# EAGLE design uRings_SE_Control_Board (EAGLE 9.6.2)
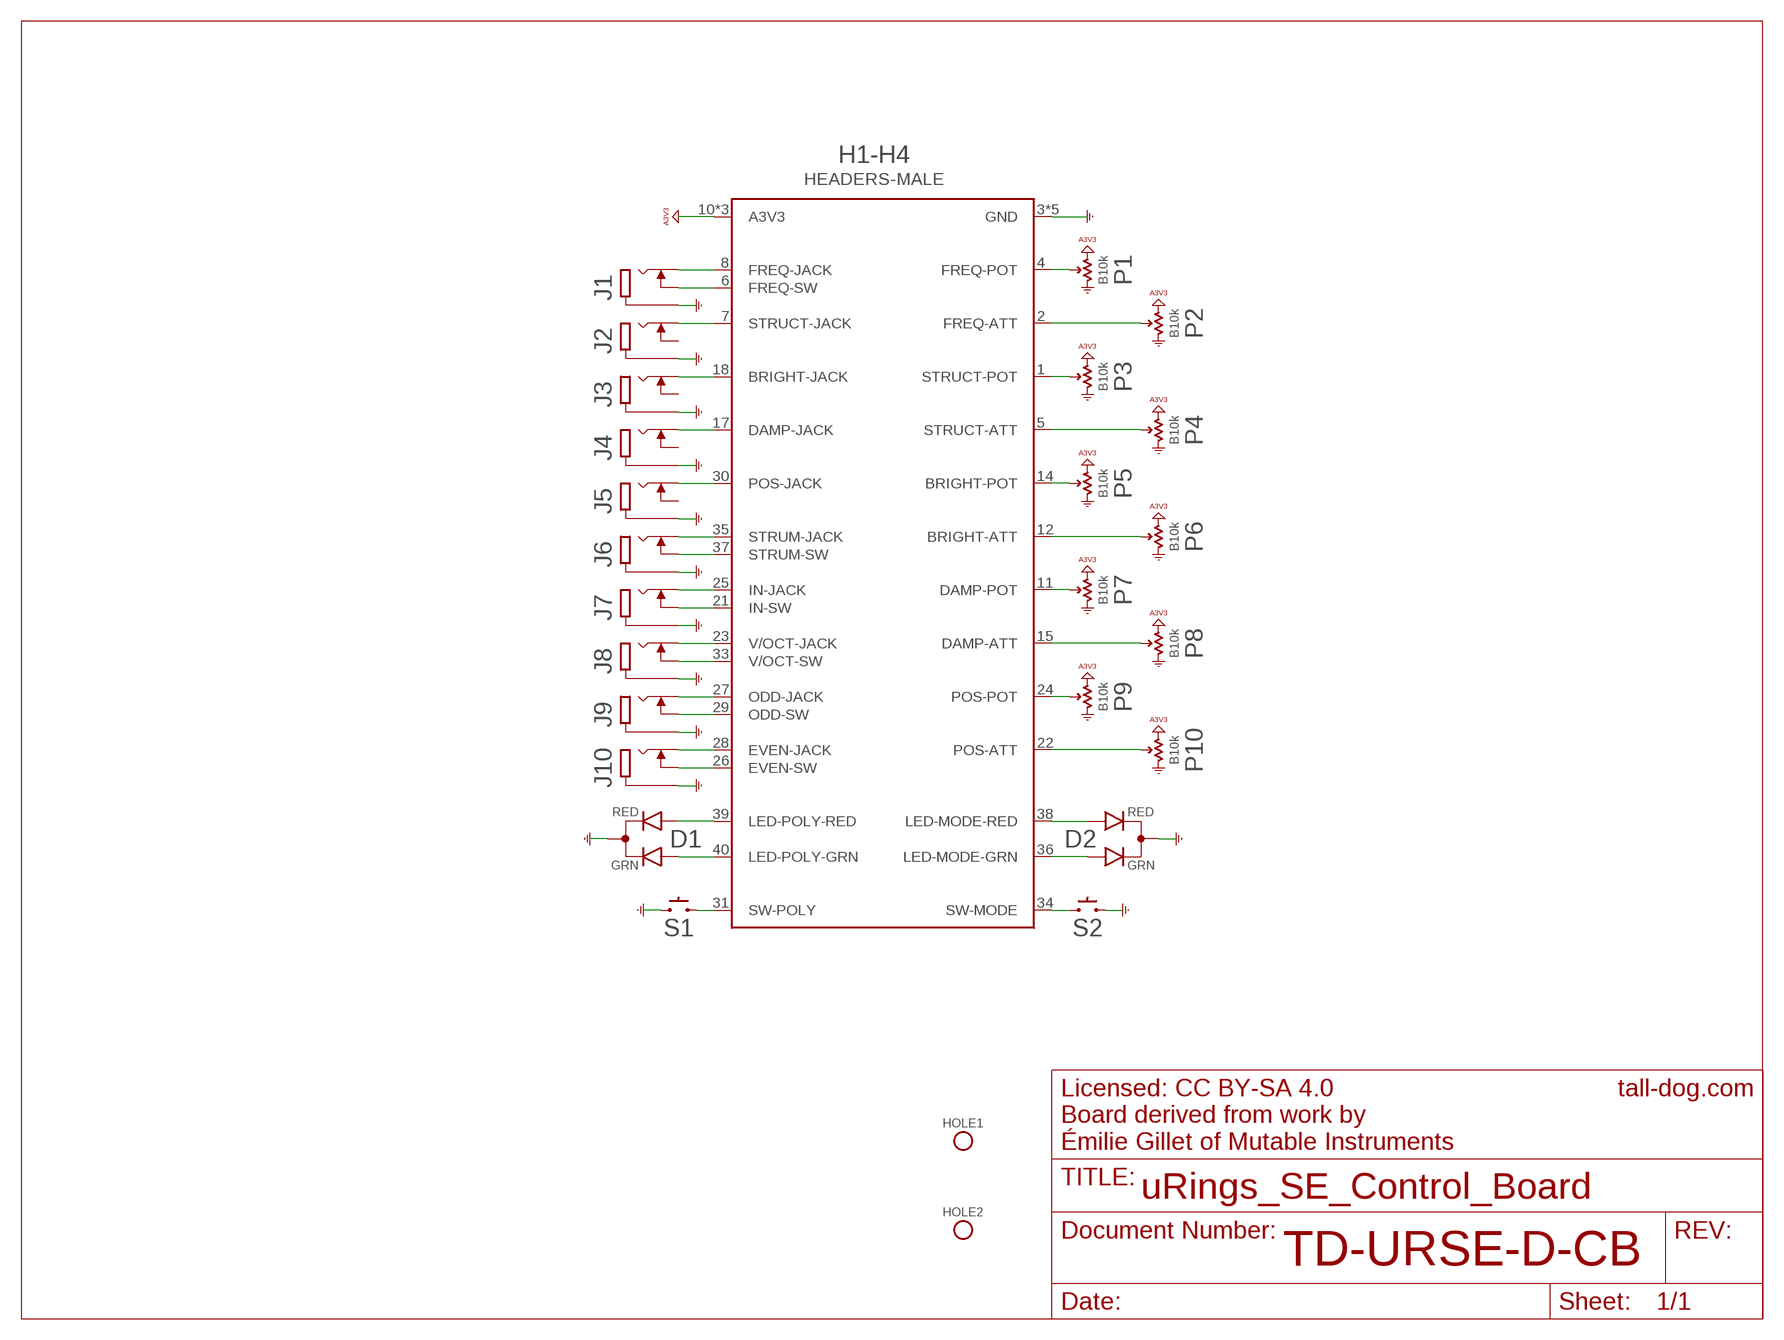
[diagram p0: schematic, sheet 1]

## Parts
D1  LED-DUAL  [LED-T1-3]
D2  LED-DUAL  [LED-T1-3]
H1-H4  HEADERS-MALE  [HEADERS-MALE]
HOLE1  HOLE  [M2.5-HOLE]
HOLE2  HOLE  [M2.5-HOLE]
J1  JACK  [JACK]
J2  JACK  [JACK]
J3  JACK  [JACK]
J4  JACK  [JACK]
J5  JACK  [JACK]
J6  JACK  [JACK]
J7  JACK  [JACK]
J8  JACK  [JACK]
J9  JACK  [JACK]
J10  JACK  [JACK]
P1  B10k  POT  [POT]
P2  B10k  POT  [POT]
P3  B10k  POT  [POT]
P4  B10k  POT  [POT]
P5  B10k  POT  [POT]
P6  B10k  POT  [POT]
P7  B10k  POT  [POT]
P8  B10k  POT  [POT]
P9  B10k  POT  [POT]
P10  B10k  POT  [POT]
S1  SPST  [TL1105]
S2  SPST  [TL1105]

## Nets
A3V3: H1-H4.10(A3V3) H1-H4.16(A3V3) H1-H4.20(A3V3) P1.P$1(E) P2.P$1(E) P3.P$1(E) P4.P$1(E) P5.P$1(E) P6.P$1(E) P7.P$1(E) P8.P$1(E) P9.P$1(E) P10.P$1(E)
BRIGHT-ATT: H1-H4.12(BRIGHT-ATT) P6.P$2(S)
BRIGHT-JACK: H1-H4.18(BRIGHT-JACK) J3.P3
BRIGHT-POT: H1-H4.14(BRIGHT-POT) P5.P$2(S)
DAMP-ATT: H1-H4.15(DAMP-ATT) P8.P$2(S)
DAMP-JACK: H1-H4.17(DAMP-JACK) J4.P3
DAMP-POT: H1-H4.11(DAMP-POT) P7.P$2(S)
EVEN-JACK: H1-H4.28(EVEN-JACK) J10.P3
EVEN-SW: H1-H4.26(EVEN-SW) J10.P2
FREQ-ATT: H1-H4.2(FREQ-ATT) P2.P$2(S)
FREQ-JACK: H1-H4.8(FREQ-JACK) J1.P3
FREQ-POT: H1-H4.4(FREQ-POT) P1.P$2(S)
FREQ-SW: H1-H4.6(FREQ-SW) J1.P2
GND: D1.2(C) D2.2(C) H1-H4.3(GND) H1-H4.9(GND) H1-H4.13(GND) H1-H4.19(GND) H1-H4.32(GND) J1.P1 J2.P1 J3.P1 J4.P1 J5.P1 J6.P1 J7.P1 J8.P1 J9.P1 J10.P1 P1.P$3(A) P2.P$3(A) P3.P$3(A) P4.P$3(A) P5.P$3(A) P6.P$3(A) P7.P$3(A) P8.P$3(A) P9.P$3(A) P10.P$3(A) S1.1 S1.2 S2.1 S2.2
IN-JACK: H1-H4.25(IN-JACK) J7.P3
IN-SW: H1-H4.21(IN-SW) J7.P2
LED-MODE-GRN: D2.3(GRN) H1-H4.36(LED-MODE-GRN)
LED-MODE-RED: D2.1(RED) H1-H4.38(LED-MODE-RED)
LED-POLY-GRN: D1.3(GRN) H1-H4.40(LED-POLY-GRN)
LED-POLY-RED: D1.1(RED) H1-H4.39(LED-POLY-RED)
ODD-JACK: H1-H4.27(ODD-JACK) J9.P3
ODD-SW: H1-H4.29(ODD-SW) J9.P2
POS-ATT: H1-H4.22(POS-ATT) P10.P$2(S)
POS-JACK: H1-H4.30(POS-JACK) J5.P3
POS-POT: H1-H4.24(POS-POT) P9.P$2(S)
STRUCT-ATT: H1-H4.5(STRUCT-ATT) P4.P$2(S)
STRUCT-JACK: H1-H4.7(STRUCT-JACK) J2.P3
STRUCT-POT: H1-H4.1(STRUCT-POT) P3.P$2(S)
STRUM-JACK: H1-H4.35(STRUM-JACK) J6.P3
STRUM-SW: H1-H4.37(STRUM-SW) J6.P2
SW-MODE: H1-H4.34(SW-MODE) S2.3 S2.4
SW-POLY: H1-H4.31(SW-POLY) S1.3 S1.4
V/OCT-JACK: H1-H4.23(V/OCT-JACK) J8.P3
V/OCT-SW: H1-H4.33(V/OCT-SW) J8.P2
Unconnected: HOLE1.P$1 HOLE1.P$2 HOLE1.P$3 HOLE1.P$4 HOLE1.P$5 HOLE1.P$6 HOLE1.P$7 HOLE1.P$8 HOLE1.P$9 HOLE2.P$1 HOLE2.P$2 HOLE2.P$3 HOLE2.P$4 HOLE2.P$5 HOLE2.P$6 HOLE2.P$7 HOLE2.P$8 HOLE2.P$9 J2.P2 J3.P2 J4.P2 J5.P2

## Notes on the sheet
- tall-dog.com
- Licensed: CC BY-SA 4.0
  Board derived from work by
  Émilie Gillet of Mutable Instruments
- TD-URSE-D-CB

## Library data of the parts
D1 D2 = uRings_SE_Library:LED-DUAL
H1-H4 = uRings_SE_Library:HEADERS-MALE
HOLE1 HOLE2 = uRings_SE_Library:HOLE
J1-J10 = uRings_SE_Library:JACK
P1-P10 = uRings_SE_Library:POT
S1 S2 = uRings_SE_Library:SPST

## Board
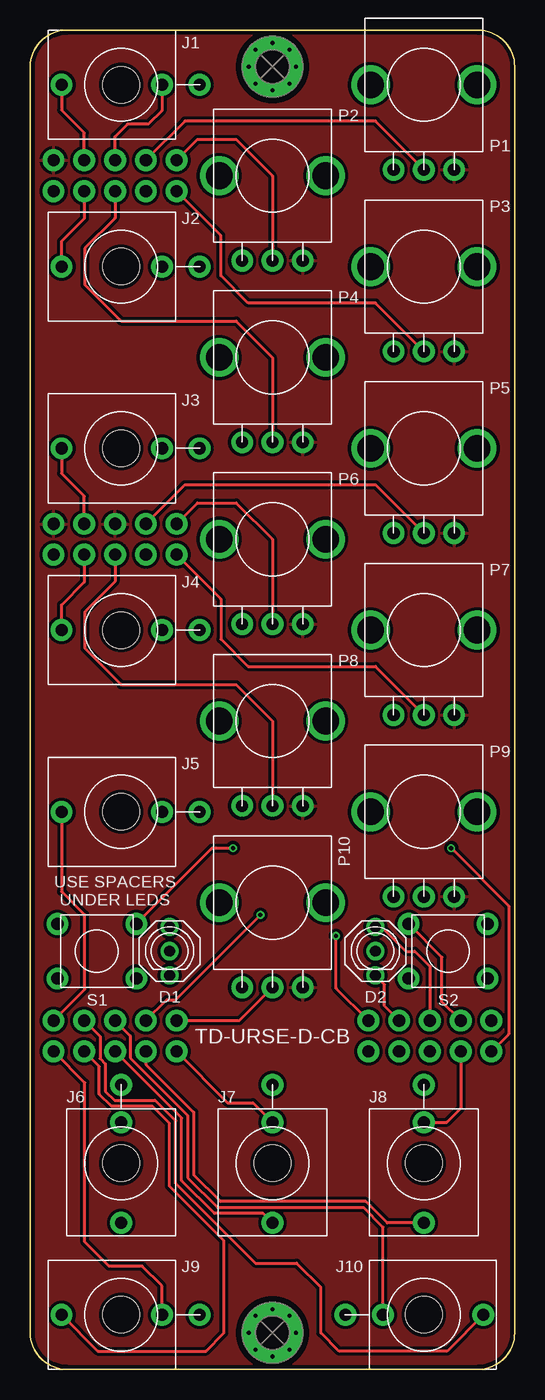
[diagram p1: board, top side]
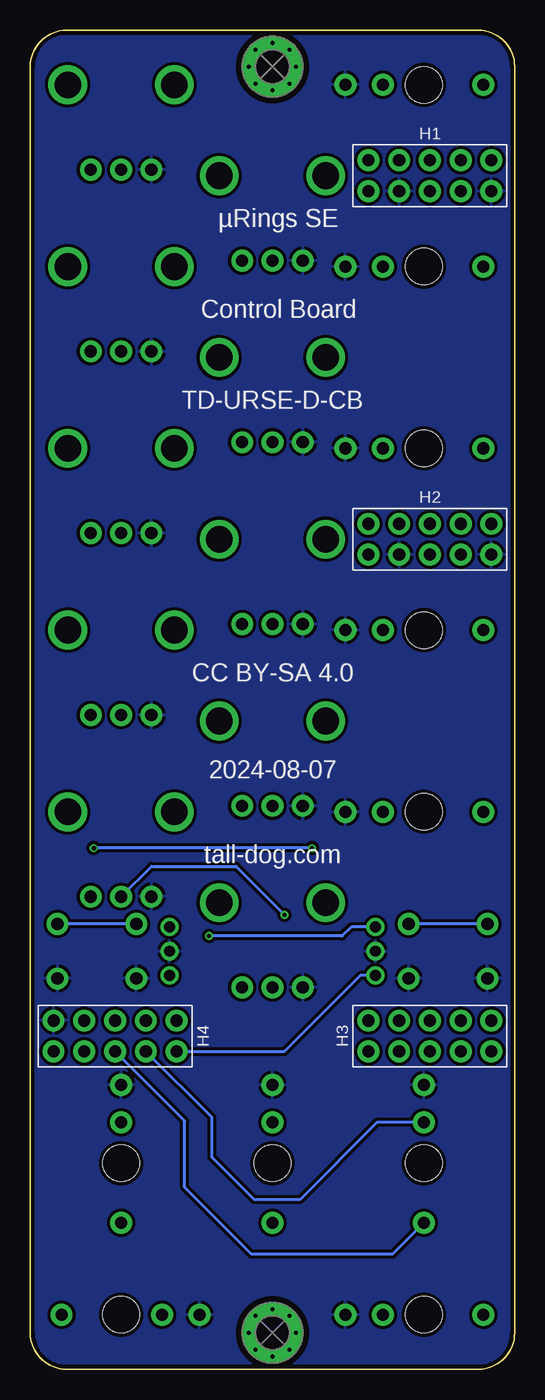
[diagram p2: board, bottom side, seen from below]

Size 40 x 110.5 mm. Coordinates in mm from the lower left corner, seen from the top.
Outline: 3,0 37,0 arc90 40,3 40,107.5 arc90 37,110.5 3,110.5 arc90 0,107.5 0,3 arc90 3,0
Copper layers (1*16): Top 0.035mm / dielectric 1.5mm / Bottom 0.035mm
Design rules "brds *": minimum track width 0.25mm, minimum drill 0.25mm, track to track 6mil, track to pad 6mil, pad to pad 6mil, via to via 6mil, smd to smd 0mil, copper to edge 12mil, drill to drill 8mil, minimum pad ring 6mil, minimum via ring 6mil, stop-mask expansion 0mil, vias tented up to drill 0.35mm, thermal gap 10mil

### Footprints (pad centres in the part's own frame; a part is rotated, then mirrored left to right if it is on the bottom)
LED-T1-3 = drill 0.9 pad 1.5: 1 -2,0; 2 0,0; 3 2,0
HEADERS-MALE = drill 1 pad 1.8: 1 12.08,97.23; 2 12.08,99.77; 3 9.54,97.23; 4 9.54,99.77; 5 7,97.23; 6 7,99.77; 7 4.46,97.23; 8 4.46,99.77; 9 1.92,97.23; 10 1.92,99.77; 11 12.08,67.23; 12 12.08,69.77; 13 9.54,67.23; 14 9.54,69.77; 15 7,67.23; 16 7,69.77; 17 4.46,67.23; 18 4.46,69.77; 19 1.92,67.23; 20 1.92,69.77; 21 12.08,26.23; 22 12.08,28.77; 23 9.54,26.23; 24 9.54,28.77; 25 7,26.23; 26 7,28.77; 27 4.46,26.23; 28 4.46,28.77; 29 1.92,26.23; 30 1.92,28.77; 31 38.08,26.23; 32 38.08,28.77; 33 35.54,26.23; 34 35.54,28.77; 35 33,26.23; 36 33,28.77; 37 30.46,26.23; 38 30.46,28.77; 39 27.92,26.23; 40 27.92,28.77
M2.5-HOLE = drill 2.75 pad 5: P$1 0,0 | drill 0.35: P$2 0,1.95; P$3 0,-1.95; P$4 -1.95,0; P$5 1.95,0; P$6 1.4,1.4; P$7 -1.4,1.4; P$8 -1.4,-1.4; P$9 1.4,-1.4
JACK = drill 1 pad 1.8: P1 0,-6.48; P2 0,-3.38; P3 0,4.92 | hole 3: 0,0
POT = drill 1 pad 1.8: P$1 -2.5,7; P$2 0,7; P$3 2.5,7 | drill 2.2 pad 3.2: P$4 -4.4,0; P$5 4.4,0
TL1105 = drill 1.016 pad 1.778: 1 -3.25,-2.25; 2 3.25,-2.25; 3 -3.25,2.25; 4 3.25,2.25

### Placement (x,y rotation side)
D1  11.5,34.5 90 top
D2  28.5,34.5 90 top
H1-H4  0,0 0 top
HOLE1  20,107.5 0 top
HOLE2  20,3 0 top
J1  7.5,106 90 top
J2  7.5,91 90 top
J3  7.5,76 90 top
J4  7.5,61 90 top
J5  7.5,46 90 top
J6  7.5,17 180 top
J7  20,17 180 top
J8  32.5,17 180 top
J9  7.5,4.5 90 top
J10  32.5,4.5 270 top
P1  32.5,106 180 top
P2  20,98.5 180 top
P3  32.5,91 180 top
P4  20,83.5 180 top
P5  32.5,76 180 top
P6  20,68.5 180 top
P7  32.5,61 180 top
P8  20,53.5 180 top
P9  32.5,46 180 top
P10  20,38.5 180 top
S1  5.5,34.5 0 top
S2  34.5,34.5 0 top
U$1  [LED-SPACER]  11.5,34.5 0 top
U$2  [LED-SPACER]  28.5,34.5 0 top

### Tracks (layer width: path | path; a pad name or v marks a point on that pad's centre or on a via)
A3V3
  pour Top (isolate 0.25): 0,110.5 40,110.5 40,0 0,0
BRIGHT-ATT
  Top 0.25: H1-H4.12 13.81,71.5 17,71.5 20,68.5 P6.P$2
BRIGHT-JACK
  Top 0.25: J3.P3 2.58,73.92 4.46,72.04 H1-H4.18
BRIGHT-POT
  Top 0.25: H1-H4.14 12.77,73 28.5,73 P5.P$2
DAMP-ATT
  Top 0.25: P8.P$2 20,53.5 17,56.5 7.5,56.5 4.5,59.5 4.5,62.5 7,65 H1-H4.15
DAMP-JACK
  Top 0.25: J4.P3 2.58,63.08 4.46,64.96 H1-H4.17
DAMP-POT
  Top 0.25: H1-H4.11 15.75,63.56 15.75,60.25 18,58 28.5,58 P7.P$2
EVEN-JACK
  Top 0.25: H1-H4.28 5.75,27.48 5.75,25.65 6.2,25.2 6.2,22.95 6.95,22.2 10.3,22.2 12,20.5 12,15.33 18.58,8.75 22,8.75 24,6.75 24,3 25.5,1.5 34.42,1.5 J10.P3
EVEN-SW
  Top 0.25: H1-H4.26 8.25,27.52 8.25,25.7 13,20.95 13,15.8 15.45,13.35 27.5,13.35 29.12,11.73 J10.P2
FREQ-ATT
  Top 0.25: H1-H4.2 13.81,101.5 17,101.5 20,98.5 P2.P$2
FREQ-JACK
  Top 0.25: H1-H4.8 4.46,102.04 2.58,103.92 J1.P3
FREQ-POT
  Top 0.25: P1.P$2 28.5,103 12.77,103 H1-H4.4
FREQ-SW
  Top 0.25: H1-H4.6 7,101.73 8.02,102.75 9.75,102.75 10.88,103.88 J1.P2
GND
  pour Bottom (isolate 0.25): 0,110.5 40,110.5 40,0 0,0
IN-JACK
  Top 0.25: H1-H4.25 12.5,20.73 12.5,15.55 15.2,12.85 19.23,12.85 J7.P3
IN-SW
  Top 0.25: H1-H4.21 16.31,22 18.38,22 J7.P2
LED-MODE-GRN
  Top 0.25: H1-H4.36 33,33.25 31.75,34.5 31,34.5 29,36.5 D2.3
LED-MODE-RED
  Top 0.25: D2.1 29.25,31.75 29.25,29.98 H1-H4.38
LED-POLY-GRN  (via drill 0.35)
  Top 0.25: H1-H4.40 25.25,31.44 v25.25,35.75
  Bottom 0.25: D1.3 13.5,36.5 14.25,35.75 v25.25,35.75
LED-POLY-RED
  Bottom 0.25: D1.1 12.75,32.5 19.02,26.23 H1-H4.39
ODD-JACK
  Top 0.25: H1-H4.27 5.7,24.99 5.7,22.7 6.7,21.7 10.1,21.7 11.5,20.3 11.5,15.1 16,10.6 16,3 14.5,1.5 5.58,1.5 J9.P3
ODD-SW
  Top 0.25: H1-H4.29 4.5,23.65 4.5,10.5 6.5,8.5 9.25,8.5 10.88,6.87 J9.P2
POS-ATT
  Top 0.25: P10.P$2 17.27,28.77 H1-H4.22
POS-JACK
  Top 0.25: J5.P3 2.58,39.42 4.5,37.5 4.5,31.35 H1-H4.30
POS-POT  (via drill 0.35)
  Top 0.25: v19,37.5 12,30.5 11.27,30.5 H1-H4.24
  Bottom 0.25: P9.P$2 30,41.5 23,41.5 v19,37.5
STRUCT-ATT
  Top 0.25: P4.P$2 20,83.5 17,86.5 7.5,86.5 4.5,89.5 4.5,92.5 7,95 H1-H4.5
STRUCT-JACK
  Top 0.25: J2.P3 2.58,93.08 4.46,94.96 H1-H4.7
STRUCT-POT
  Top 0.25: P3.P$2 28.5,88 18,88 15.75,90.25 15.75,93.56 H1-H4.1
STRUM-JACK
  Bottom 0.25: H1-H4.35 27.25,20.48 27.25,15 21.75,9.5 10.08,9.5 J6.P3
STRUM-SW
  Bottom 0.25: J6.P2 11.37,20.38 17.75,14 21.5,14 25,17.5 25,20.77 H1-H4.37
SW-MODE
  Top 0.25: S2.3 34,34 34,30.31 H1-H4.34
  Bottom 0.25: S2.3 S2.4
SW-POLY  (via drill 0.35)
  Top 0.25: S1.4 15,43 v16.75,43 | v34.75,43 39.5,38.25 39.5,27.65 H1-H4.31
  Bottom 0.25: S1.3 S1.4 | v16.75,43 v34.75,43
V/OCT-JACK
  Top 0.25: H1-H4.23 9.54,25.16 13.5,21.2 13.5,16.05 15.7,13.85 27.7,13.85 29.47,12.08 J8.P3
V/OCT-SW
  Top 0.25: H1-H4.33 35.54,21.54 34.38,20.38 J8.P2

### Text on the board
tPlace: USE SPACERS / UNDER LEDS | TD-URSE-D-CB
bPlace: H1 | µRings SE | Control Board | TD-URSE-D-CB | H2 | CC BY-SA 4.0 | 2024-08-07 | tall-dog.com | H3 | H4
tDocu: USE SPACERS UNDER LEDS
bDocu: H1 | H2 | H3 | H4